# Altium schematic sheet GeekIMUv1 Reciver.SchDoc
size 254 x 190 mm
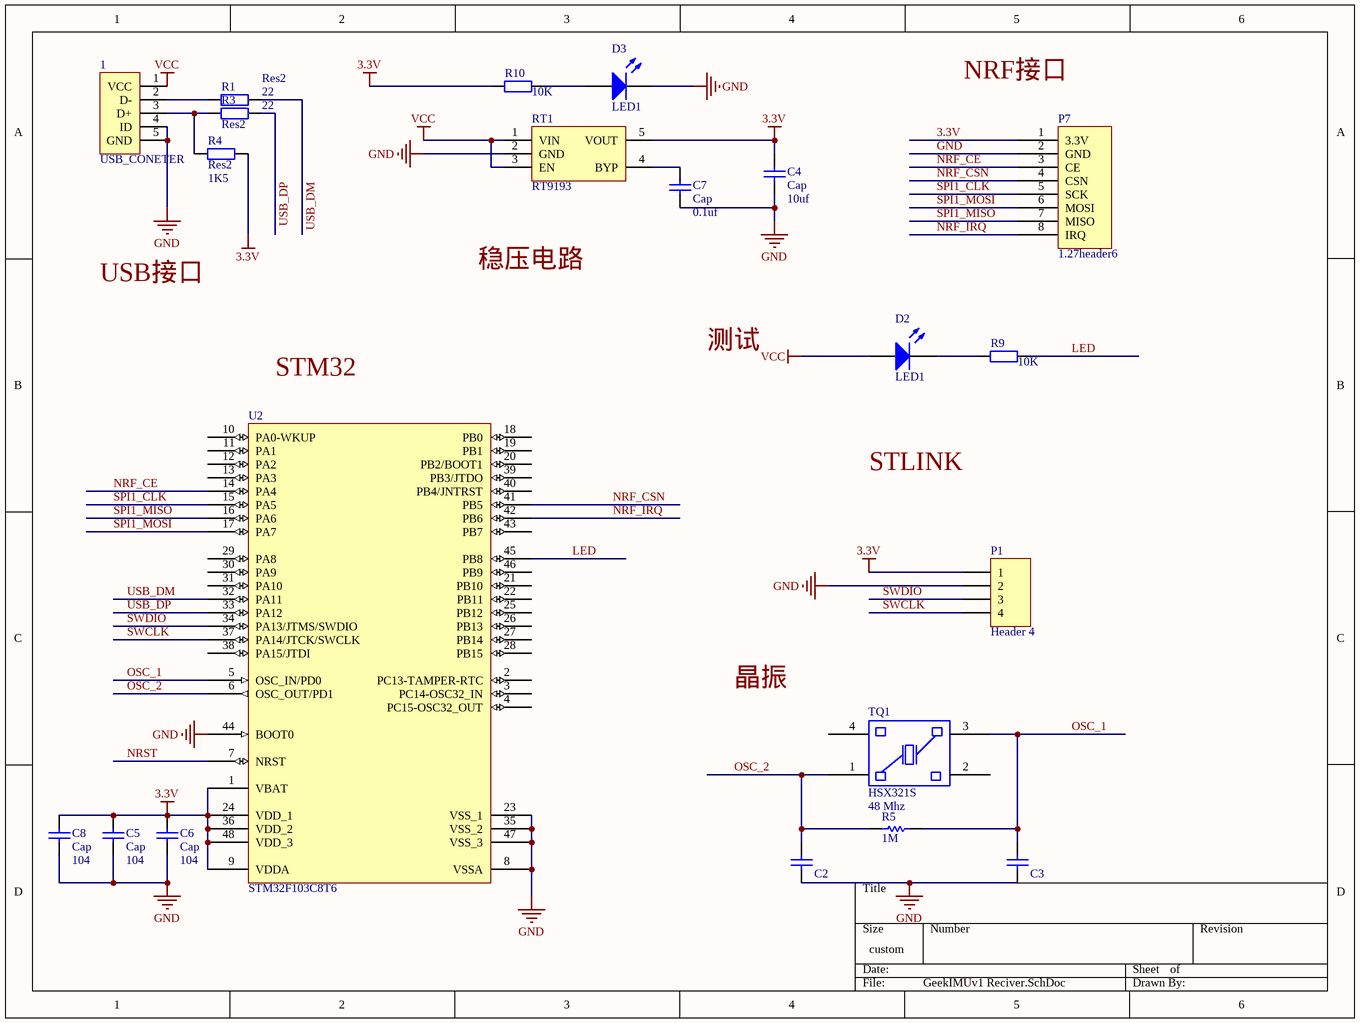
[diagram p0: GeekIMUv1 Reciver.SchDoc]

## Parts
1  USB_CONETER  [USB A Plug]
C2  Cap  [C0402]  (value not drawn)
C3  Cap  [C0402]  (value not drawn)
C4  Cap  value 10uf  [C0603]
C5  Cap  value 104  [C0402]
C6  Cap  value 104  [C0402]
C7  Cap  value 0.1uf  [B0402]
C8  Cap  value 104  [C0402]
D2  LED1  [C0402]
D3  LED1  [C0402]
P1  Header 4  [HDR1X4]
P7  1.27header6  [1.27header6]
R1  Res2  value 22  [B0402]
R3  Res2  value 22  [B0402]
R4  Res2  value 1K5  [B0402]
R5  value 1M  [R0402]  (hidden comment: Res Semi)
R9  value 10K  [B0402]
R10  value 10K  [B0402]
RT1  RT9193  [SOT23-5]
TQ1  HSX321S  value 48 Mhz  [DSX321G]
U2  STM32F103C8T6  [LQFP48]

## Nets
3.3V: C4.2 C5.2 C6.2 C8.2 P1.1 P7.1(3.3V) R4.2 R10.2 RT1.5(VOUT) U2.1(VBAT) U2.9(VDDA) U2.24(VDD_1) U2.36(VDD_2) U2.48(VDD_3)
GND: 1.4(ID) 1.5(GND) C2.1 C3.1 C4.1 C5.1 C6.1 C7.1 C8.1 D3.2(K) P1.2 P7.2(GND) RT1.2(GND) U2.8(VSSA) U2.23(VSS_1) U2.35(VSS_2) U2.44(BOOT0) U2.47(VSS_3)
VCC: 1.1(VCC) D2.1(A) RT1.1(VIN) RT1.3(EN)
LED: R9.1 U2.45(PB8)
NRF_CE: P7.3(CE) U2.14(PA4)
NRF_CSN: P7.4(CSN) U2.41(PB5)
NRF_IRQ: P7.8(IRQ) U2.42(PB6)
NRST: U2.7(NRST)
OSC_1: C3.2 R5.2 TQ1.3 U2.5(OSC_IN/PD0)
OSC_2: C2.2 R5.1 TQ1.1 U2.6(OSC_OUT/PD1)
SPI1_CLK: P7.5(SCK) U2.15(PA5)
SPI1_MISO: P7.7(MISO) U2.16(PA6)
SPI1_MOSI: P7.6(MOSI) U2.17(PA7)
SWCLK: P1.4 U2.37(PA14/JTCK/SWCLK)
SWDIO: P1.3 U2.34(PA13/JTMS/SWDIO)
USB_DM: R1.2 U2.32(PA11)
USB_DP: R3.2 U2.33(PA12)
Net1_2: 1.2(D-) R1.1
Net1_3: 1.3(D+) R3.1 R4.1
NetC7_2: C7.2 RT1.4(BYP)
NetD2_2: D2.2(K) R9.2
NetD3_1: D3.1(A) R10.1

Not connected (* = marked no-connect by the designer): TQ1 2 4; U2 2(PC13-TAMPER-RTC) 3(PC14-OSC32_IN) 4(PC15-OSC32_OUT) 10(PA0-WKUP) 11(PA1) 12(PA2) 13(PA3) 18(PB0) 19(PB1) 20(PB2/BOOT1) 21(PB10) 22(PB11) 25(PB12) 26(PB13) 27(PB14) 28(PB15) 29(PA8) 30(PA9) 31(PA10) 38(PA15/JTDI) 39(PB3/JTDO) 40(PB4/JNTRST) 43(PB7) 46(PB9)

## Notes on the sheet
- Labels drawn without touching a wire or pin: NRF接口, STLINK, STM32, USB接口, 晶振, 测试, 稳压电路

## Library data of the parts
1 = USB_conect_B: USB; Published: 24-Mar-1999; LatestRevisionDate: 17-Jul-2002; LatestRevisionNote: Re-released for DXP Platform.; PackageReference: D2PAK; Publisher: Altium Limited; Code_JEDEC: SMD-220
C2 C3 = Cap: Product model: Product?; Value: Value?; Vendor: Vendor?
C4-C8 = Cap: Capacitor; Published: 8-Jun-2000; LatestRevisionDate: 17-Jul-2002; LatestRevisionNote: Re-released for DXP Platform.; PackageReference: RAD-0.3; Publisher: Altium Limited
  C4 C7: PackageDescription: Radial Cap, Thru-Hole; 2 Leads; 0.3 in Pin Spacing
D2 D3 = LED1: Typical RED GaAs LED; Published: 8-Jun-2000; LatestRevisionDate: 08-Jul-2005; LatestRevisionNote: Mech Layer 1 removed.; PackageReference: LED-1; Publisher: Altium Limited
P1 = Header 4: Header, 4-Pin; LatestRevisionDate: 17-Jul-2002; LatestRevisionNote: Re-released for DXP Platform.; Publisher: Altium Limited
R1 R3 R4 R9 R10 = Res2: Resistor; Published: 8-Jun-2000; LatestRevisionDate: 17-Jul-2002; LatestRevisionNote: Re-released for DXP Platform.; PackageReference: AXIAL-0.4; Publisher: Altium Limited
R5 = Res Semi: Semiconductor Resistor; Vendor: V?; Product model: P?
RT1 = RT9193: Power
TQ1 = HSX321S: XTAL; Vendor: TXC,台湾晶技; Product model: 7C Series
U2 = STM32F103C8T6: STM32 ARM-based 32-bit MCU with 64 Kbytes Flash, 48-pin LQFP, Industrial Temperature; Published: 30-May-2008; DatasheetVersion: rev6, Mar-2008; PackageVersion: Mar-2008; PackageReference: LQFP48; Publisher: Altium Limited; PackageDescription: 48-Pin Low-Profile Quad Flat Pack, 7 x 7 mm Body, 0.5 mm Pitch (LQFP48); ComponentLink1Description: Manufacturer Link; ComponentLink1URL: www.st.com/stm32; ComponentLink2Description: Datasheet; ComponentLink2URL: http://www.st.com/stonline/products/literature/ds/13587.pdf